# Altium schematic sheet main.SchDoc
size A4; SheetNumber: 1; SheetTotal: 6
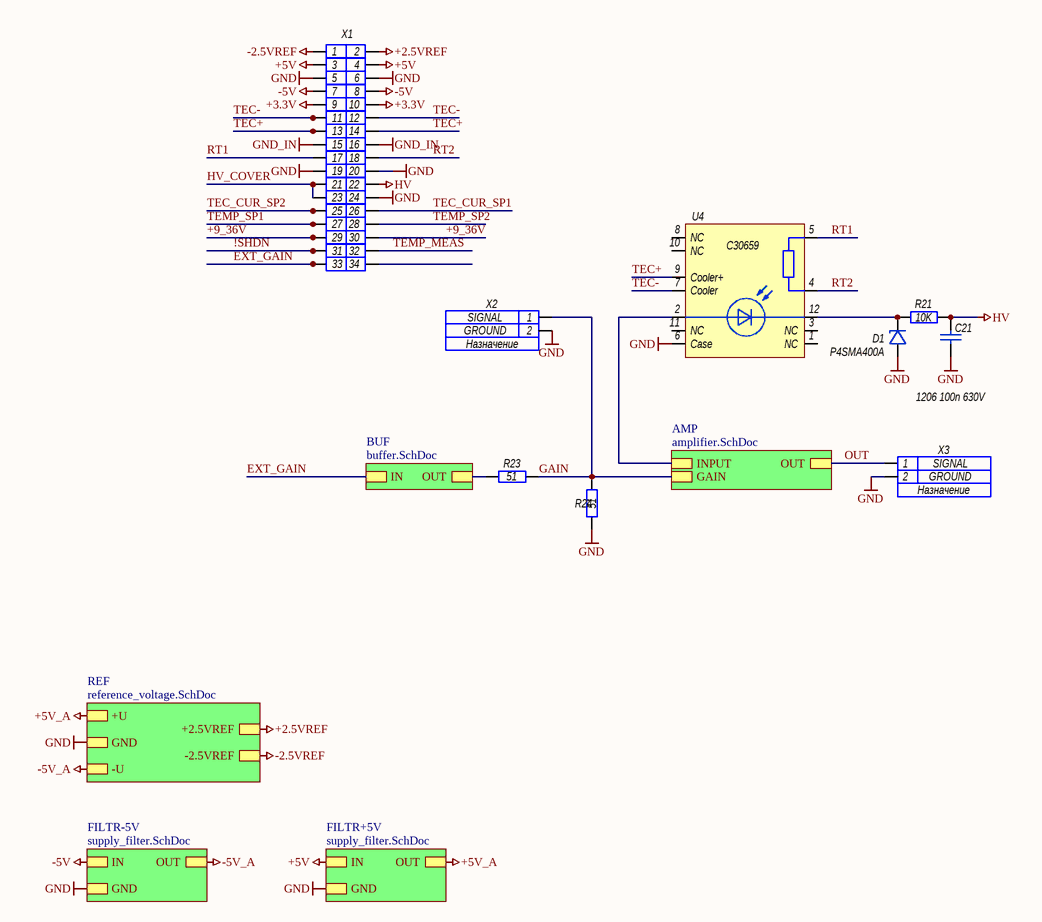
[diagram p0: main.SchDoc]

## Parts
C21  1206 100n 630V  [CAP_2220]
D1  P4SMA400A  [SOD-123]
R21  10K  [RES_0805]
R23  51  [RES_0603]
R24  51  [RES_0603]
U4  C30659  [C30659]
X1  ?  [BH-34]  (value not drawn)
X2  Net1: SIGNAL  Net2: GROUND  Name: Назначение  [SMA_V]  (hidden comment: Model)
X3  Net1: SIGNAL  Net2: GROUND  Name: Назначение  [SMA_V]  (hidden comment: Model)

## Sub-sheets
AMP = amplifier.SchDoc: GAIN, INPUT, OUT
BUF = buffer.SchDoc: IN, OUT
FILTR+5V = supply_filter.SchDoc: IN, OUT, GND
FILTR-5V = supply_filter.SchDoc: IN, OUT, GND
REF = reference_voltage.SchDoc: GND, -U, -2.5VREF, +2.5VREF, +U

## Nets
+2.5VREF: X1.2 ; sheet REF/+2.5VREF
+3.3V: X1.9 X1.10
+5V: X1.3 X1.4 ; sheet FILTR+5V/IN
+5V_A: sheet REF/+U, sheet FILTR+5V/OUT
-2.5VREF: X1.1 ; sheet REF/-2.5VREF
-5V: X1.7 X1.8 ; sheet FILTR-5V/IN
-5V_A: sheet REF/-U, sheet FILTR-5V/OUT
GND: C21.2 D1.1 R24.1 U4.6(Case) X1.5 X1.6 X1.19 X1.20 X1.24 X2.G(2) X3.G(2) ; sheet REF/GND, sheet FILTR+5V/GND, sheet FILTR-5V/GND
GND_IN: X1.15 X1.16
HV: C21.1 R21.2 X1.22
!SHDN: X1.31
+9_36V: X1.29 X1.30
EXT_GAIN: X1.33 ; sheet BUF/IN
GAIN: R23.2 R24.2 X2.S(1) ; sheet AMP/GAIN
HV_COVER: X1.21 X1.23
OUT: X3.S(1) ; sheet AMP/OUT
RT1: U4.5 X1.17
RT2: U4.4 X1.18
TEC+: U4.9(Cooler+) X1.13 X1.14
TEC-: U4.7(Cooler) X1.11 X1.12
TEC_CUR_SP1: X1.26
TEC_CUR_SP2: X1.25
TEMP_MEAS: X1.32
TEMP_SP1: X1.27
TEMP_SP2: X1.28
NetD1_2: D1.2 R21.1 U4.12
NetR23_1: R23.1 ; sheet BUF/OUT
NetU4_2: U4.2 ; sheet AMP/INPUT

Not connected (* = marked no-connect by the designer): U4 1(NC) 3(NC) 8(NC) 10(NC) 11(NC); X1 34

## Library data of the parts
C21 = Capacitor: Конденсатор
D1 = SMFxxA: Диод защитный; ValueBOM: -; ValueSCH: -; MarkPCB: -; HelpURL: C:\Datasheets\SMF.pdf
R21 = Resisitor: Резистор; ValueBOM: 0805 10k 0.125; MarkPCB: 103; ValueSCH: 10k
R23 R24 = Resisitor: Резистор; ValueBOM: 0805 10k 0.125; ValueSCH: 10k; MarkPCB: 103
U4 = C30659: Модуль с ЛФД; ValueBOM: C30659; ValueSCH: C30659; MarkPCB: C30659; HelpURL: C:\Datasheets\C30659.pdf
X1 = Connector 17x2: ValueSCH: Model
X2 X3 = Connector 2: ValueSCH: Model